# Altium schematic sheet USB Connectors.SchDoc
size A; SheetNumber: 5; SheetTotal: 7
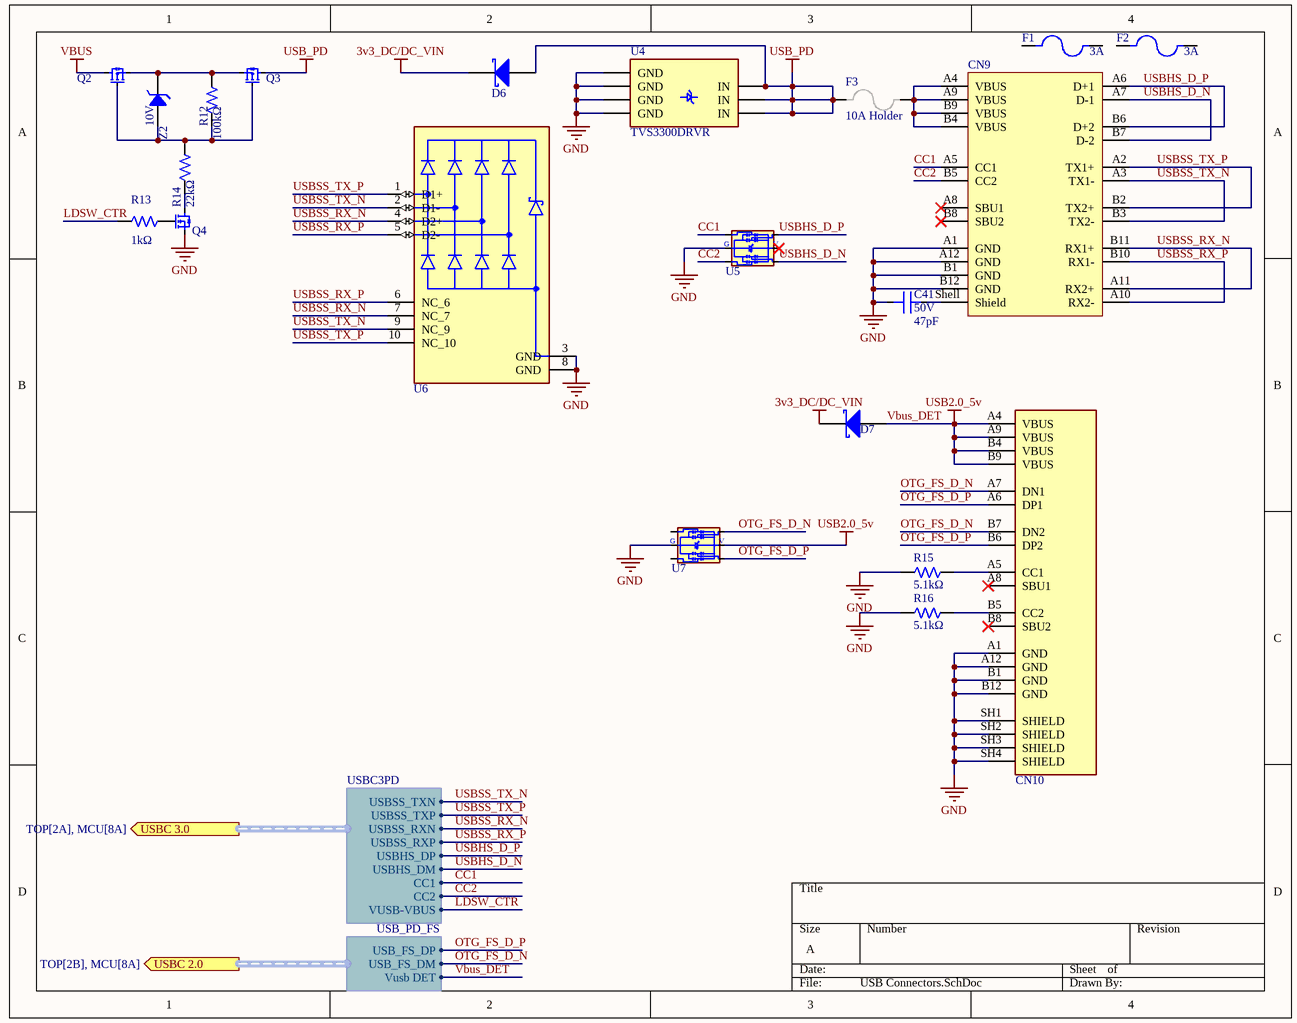
[diagram p0: USB Connectors.SchDoc]

## Parts
C41  Voltage Rating: 50V  Capacitance: 47pF  [C_0603]  (hidden comment: CAP CER 47pF 50V C0G 0603)
CN9  CONN RCPT USB 3.1 Type-C 24POS SMD R/A  [CONN_TYPE-C_24P_SMD_RA]  (value not drawn)
CN10  CONN RCPT USB 3.1 Type-C 16POS TH R/A  [CONN_TYPE-C_16P_TH_RA]  (value not drawn)
D6  DIODE SCHOTTKY 40V SOD-323  [SOD323]  (value not drawn)
D7  DIODE SCHOTTKY 40V SOD-323  [SOD323]  (value not drawn)
F1  3A  (mechanical)
F2  3A  (mechanical)
F3  10A Holder  [FUSE_SMD 2410 HOLDER]
Q2  MOSFET P-CH 30V 4A SOT-23  [SOT23]  (value not drawn)
Q3  MOSFET P-CH 30V 4A SOT-23  [SOT23]  (value not drawn)
Q4  MOSFET N-CH 30V SOT-23-3L  [SOT23]  (value not drawn)
R12  Resistance: 100kΩ  [R_0603]  (hidden comment: RES 100kΩ ±1% 100mW 0603)
R13  Resistance: 1kΩ  [R_0603]  (hidden comment: RES 1kΩ ±1% 100mW 0603)
R14  Resistance: 22kΩ  [R_0603]  (hidden comment: RES 22kΩ ±1% 100mW 0603)
R15  Resistance: 5.1kΩ  [R_0603]  (hidden comment: RES 5.1kΩ ±1% 100mW 0603)
R16  Resistance: 5.1kΩ  [R_0603]  (hidden comment: RES 5.1kΩ ±1% 100mW 0603)
U4  TVS3300DRVR  [WSON-6(2x2)]
U5  ESD DIODE 5.5VWM 18VC SOT-23-6  [SOT-23-6]  (value not drawn)
U6  TVS DIODE 5.5VWM 14VC USON-10(1x2.5)  [USON-10]  (value not drawn)
U7  ESD DIODE 5.5VWM 18VC SOT-23-6  [SOT-23-6]  (value not drawn)
Z2  Zener Voltage: 10V  [SOD123]  (hidden comment: DIODE ZENER 10V 500mW SOD-123)

## Ports
USBC 2.0 (out, harness USB_PD_FS, see TOP[2B], MCU[8A]), USBC 3.0 (out, harness USBC3PD, see TOP[2A], MCU[8A])

## Harnesses
USBC3PD: USBHS_DM, USBHS_DP, USBSS_RXP, USBSS_RXN, USBSS_TXP, USBSS_TXN, CC1, CC2, VUSB-VBUS
USB_PD_FS: USB_FS_DP, USB_FS_DM, Vusb DET

## Nets
3v3_DC/DC_VIN: D6.2(K) D7.2(K)
GND: C41.1 CN9.A1(GND) CN9.A12(GND) CN9.B1(GND) CN9.B12(GND) CN10.A1(GND) CN10.A12(GND) CN10.B1(GND) CN10.B12(GND) CN10.SH1(SHIELD) CN10.SH2(SHIELD) CN10.SH3(SHIELD) CN10.SH4(SHIELD) Q4.2(SOURCE) R15.1 R16.1 U4.1(GND) U4.2(GND) U4.3(GND) U4.7(GND) U5.2 U6.3(GND) U6.8(GND) U7.2
USB_PD: D6.1(A) F3.1 Q3.3(DRAIN) U4.4(IN) U4.5(IN) U4.6(IN)
VBUS: Q2.3(DRAIN)
Vbus_DET: CN10.A4(VBUS) CN10.A9(VBUS) CN10.B4(VBUS) CN10.B9(VBUS) D7.1(A) U7.5 ; port USBC 2.0.Vusb DET  [also labelled USB2.0_5v]
CC1: CN9.A5(CC1) U5.1 ; port USBC 3.0.CC1
CC2: CN9.B5(CC2) U5.3 ; port USBC 3.0.CC2
LDSW_CTR: R13.1 ; port USBC 3.0.VUSB-VBUS
OTG_FS_D_N: CN10.A7(DN1) CN10.B7(DN2) U7.6 ; port USBC 2.0.USB_FS_DM
OTG_FS_D_P: CN10.A6(DP1) CN10.B6(DP2) U7.4 ; port USBC 2.0.USB_FS_DP
USBHS_D_N: CN9.A7(D-1) CN9.B7(D-2) U5.4 ; port USBC 3.0.USBHS_DM
USBHS_D_P: CN9.A6(D+1) CN9.B6(D+2) U5.6 ; port USBC 3.0.USBHS_DP
USBSS_RX_N: CN9.A11(RX2+) CN9.B11(RX1+) U6.4(D2+) U6.7(NC_7) ; port USBC 3.0.USBSS_RXN
USBSS_RX_P: CN9.A10(RX2-) CN9.B10(RX1-) U6.5(D2-) U6.6(NC_6) ; port USBC 3.0.USBSS_RXP
USBSS_TX_N: CN9.A3(TX1-) CN9.B3(TX2-) U6.2(D1-) U6.9(NC_9) ; port USBC 3.0.USBSS_TXN
USBSS_TX_P: CN9.A2(TX1+) CN9.B2(TX2+) U6.1(D1+) U6.10(NC_10) ; port USBC 3.0.USBSS_TXP
NetC41_2: C41.2 CN9.Shell(Shield)
NetCN9_A4: CN9.A4(VBUS) CN9.A9(VBUS) CN9.B4(VBUS) CN9.B9(VBUS) F3.2
NetCN10_A5: CN10.A5(CC1) R15.2
NetCN10_B5: CN10.B5(CC2) R16.2
NetQ2_1: Q2.1(GATE) Q3.1(GATE) R12.1 R14.2 Z2.1
NetQ2_2: Q2.2(SOURCE) Q3.2(SOURCE) R12.2 Z2.2
NetQ4_1: Q4.1(GATE) R13.2
NetQ4_3: Q4.3(DRAIN) R14.1

Not connected (* = marked no-connect by the designer): CN9 A8(SBU1)* B8(SBU2)*; CN10 A8(SBU1)* B8(SBU2)*; F1 1 2; F2 1 2; U5 5*; U7 1 3

## Notes on the sheet
- (in symbol AOZ8904CIL) G; V

## Library data of the parts
C41 = C1671: 47pF ±5% 50V Ceramic Capacitor C0G 0603; Manufacturer: Samsung Electro-Mechanics; MPN: CL10C470JB8NNNC; Symbol Path 1: Symbols\Standard.SchLib; Unit Price (USD): 0.011; LCSC Part #: C1671; Package: 0603; JLC Part Type: Basic; LCSC Stock: 658700; JLC Stock: 1229214; MOQ: 100; Datasheet: https://datasheet.lcsc.com/datasheet/pdf/02336ea48ea44ca18c72517dd3cb7b47.pdf?productCode=C1671; URL: https://www.lcsc.com/product-detail/C1671.html; Status: ok; Tolerance: ±5%; TempCo: C0G
CN9 = TYPE-C 24P QT 143: USB-C (USB TYPE-C) Receptacle Connector 24 Position Surface Mount, Right Angle; Manufacturer: SHOU HAN; Symbol Path 1: Symbols\Standard.SchLib; Unit Price (USD): 0.4524; Positions: 24P; MPN: TYPE-C 24P QT 143; LCSC Part #: C5156605; Package: SMD; JLC Part Type: Extended; LCSC Stock: 27844; JLC Stock: 27844; MOQ: 1; Datasheet: https://datasheet.lcsc.com/datasheet/pdf/5e2518a21a03f1086118bfdc224ba041.pdf?productCode=C5156605; URL: https://www.lcsc.com/product-detail/C5156605.html; Status: ok; Mounting Type: Surface Mount, Right Angle; Type: Type-C
CN10 = TYPEC-306DDW-ARP16: USB-C (USB TYPE-C) Receptacle Connector 16 Position Right Angle; Manufacturer: XUNPU; Symbol Path 1: Symbols\Standard_CONN.SchLib; Unit Price (USD): 0.8482; Positions: 16P; MPN: TYPEC-306DDW-ARP16; LCSC Part #: C2840393; Package: THROUGH HOLE,RIGHT ANGLE; JLC Part Type: Extended; LCSC Stock: 2945; JLC Stock: 2962; MOQ: 1; Datasheet: https://datasheet.lcsc.com/datasheet/pdf/69a9ba2274492f854bbf6d61200cd4bb.pdf?productCode=C2840393; URL: https://www.lcsc.com/product-detail/C2840393.html; Status: ok; Mounting Type: Right Angle; Type: Type-C
D6 D7 = 1N5819WS: Diode 40V 1A Surface Mount SOD-323; Manufacturer: Guangdong Hottech; Symbol Path 1: Symbols\Standard.SchLib; Unit Price (USD): 0.0139; Forward Voltage: 600mV@1A; MPN: 1N5819WS; LCSC Part #: C191023; Package: SOD-323; JLC Part Type: Basic; LCSC Stock: 4984450; JLC Stock: 5626571; MOQ: 50; Datasheet: https://datasheet.lcsc.com/datasheet/pdf/c7a6590686b7be2f86b8eed4480e569c.pdf?productCode=C191023; URL: https://www.lcsc.com/product-detail/C191023.html; Status: ok; Voltage Rating: 40V; Current Rating: 1A; Subcategory: Schottky
F1 F2 = JFC2410-1300FS: FUSE BRD MNT 3A 2410; Supplier 1: LCSC; Supplier Part Number 1: C2994709; ComponentLink1Description: Makers; ComponentLink1URL: https://makerselectronics.com/product/smd-fuse-fast-blow-3a-2410-50a-6-1x2-69x2-69mm/
F3 = 01550900M: FUSE BLOK CARTRIDGE 125V 10A SMD; Supplier 1: DigiKey; Supplier Part Number 1: F1889-ND; Supplier 2: LCSC; Supplier Part Number 2: C108518
Q2 Q3 = AO3401A: 30V 4A Surface Mount SOT-23; Manufacturer: AOS; Symbol Path 1: Symbols\Standard.SchLib; Unit Price (USD): 0.0951; Rds: 47mΩ@10V;60mΩ@4.5V;85mΩ@2.5V; Vgs(th): 900mV; MPN: AO3401A; LCSC Part #: C15127; Package: SOT-23; JLC Part Type: Basic; LCSC Stock: 115510; JLC Stock: 469891; MOQ: 5; Datasheet: https://datasheet.lcsc.com/datasheet/pdf/fee353dd1e9e0bc90b295f14f381aa4c.pdf?productCode=C15127; URL: https://www.lcsc.com/product-detail/C15127.html; Status: ok; Vds: 30V; Id: 4A
Q4 = AO3400A: N-Channel 30V Surface Mount SOT-23-3L; Manufacturer: AOS; Symbol Path 1: Symbols\Standard.SchLib; Unit Price (USD): 0.0849; Id: 5.7A; Rds: 48mΩ@2.5V; Vgs(th): 1.45V; Supplier 1: DigiKey; Supplier Part Number 1: 785-1000-1-ND; Supplier 2: LCSC; Supplier Part Number 2: C20917; MPN: AO3400A; LCSC Part #: C20917; Package: SOT-23; JLC Part Type: Basic; LCSC Stock: 656120; JLC Stock: 1217370; MOQ: 5; Datasheet: https://datasheet.lcsc.com/datasheet/pdf/130876b936da464599428c58fd8de8f6.pdf?productCode=C20917; URL: https://www.lcsc.com/product-detail/C20917.html; Status: ok; Type: N-Channel; Vds: 30V
R12 = C25803: 100kΩ ±1% 100mW 0603 Thick Film Resistor; MPN: 0603WAF1003T5E; Manufacturer: UNI-ROYAL; Symbol Path 1: Symbols\Standard.SchLib; Unit Price (USD): 0.0042; Voltage Rating: 75V; TempCo: ±100ppm/℃; LCSC Part #: C25803; Package: 0603; Datasheet: https://datasheet.lcsc.com/datasheet/pdf/0a975aaa49b7c97f38a963127be4a823.pdf?productCode=C25803; Power: 100mW; JLC Part Type: Basic; LCSC Stock: 13059500; JLC Stock: 21549170; MOQ: 100; URL: https://www.lcsc.com/product-detail/C25803.html; Status: ok; Tolerance: ±1%; Composition: Thick Film Resistor
R13 = 0603WAF1001T5E: 1kΩ ±1% 100mW 0603 Thick Film Resistor; Manufacturer: UNI-ROYAL; Symbol Path 1: Symbols\Standard.SchLib; Unit Price (USD): 0.0058; Voltage Rating: 75V; TempCo: ±100ppm/℃; MPN: 0603WAF1001T5E; Package: 0603; Datasheet: https://datasheet.lcsc.com/datasheet/pdf/0a975aaa49b7c97f38a963127be4a823.pdf?productCode=C21190; Power: 100mW; LCSC Part #: C21190; JLC Part Type: Basic; LCSC Stock: 7626000; JLC Stock: 31254885; MOQ: 100; URL: https://www.lcsc.com/product-detail/C21190.html; Status: ok; Tolerance: ±1%; Composition: Thick Film Resistor
R14 = C31850: 22kΩ ±1% 100mW 0603 Thick Film Resistor; MPN: 0603WAF2202T5E; Manufacturer: UNI-ROYAL; Symbol Path 1: Symbols\Standard.SchLib; Unit Price (USD): 0.0067; Voltage Rating: 75V; TempCo: ±100ppm/℃; LCSC Part #: C31850; Package: 0603; Datasheet: https://datasheet.lcsc.com/datasheet/pdf/0a975aaa49b7c97f38a963127be4a823.pdf?productCode=C31850; Power: 100mW; JLC Part Type: Basic; LCSC Stock: 3044300; JLC Stock: 4293246; MOQ: 100; URL: https://www.lcsc.com/product-detail/C31850.html; Status: ok; Tolerance: ±1%; Composition: Thick Film Resistor
R15 R16 = 0603WAF5101T5E: 5.1kΩ ±1% 100mW 0603 Thick Film Resistor; Manufacturer: UNI-ROYAL; Symbol Path 1: Symbols\Standard.SchLib; Unit Price (USD): 0.0026; Voltage Rating: 75V; TempCo: ±100ppm/℃; MPN: 0603WAF5101T5E; Package: 0603; Datasheet: https://datasheet.lcsc.com/datasheet/pdf/0a975aaa49b7c97f38a963127be4a823.pdf?productCode=C23186; Power: 100mW; LCSC Part #: C23186; JLC Part Type: Basic; LCSC Stock: 11090800; JLC Stock: 15519253; MOQ: 100; URL: https://www.lcsc.com/product-detail/C23186.html; Status: ok; Tolerance: ±1%; Composition: Thick Film Resistor
U4 = TVS3300DRVR: Surge Protection IC Surface Mount WSON-6(2x2); Manufacturer: TI; Symbol Path 1: Symbols\Standard_ICs.SchLib; Unit Price (USD): 0.5261; MPN: TVS3300DRVR; LCSC Part #: C2863624; Package: WSON-6(2x2); JLC Part Type: Extended; LCSC Stock: 353; JLC Stock: 353; MOQ: 1; Datasheet: https://www.ti.com/cn/lit/ds/symlink/tvs3300.pdf; URL: https://www.lcsc.com/product-detail/C2863624.html; Status: ok; Category: Circuit Protection; Subcategory: Surge Suppression ICs
U5 U7 = AOZ8904CIL: 18VC Clamp 4A@8/20us Ipp ESD DIODE SOT-23-6; Manufacturer: AOS; Symbol Path 1: Symbols\Standard.SchLib; Unit Price (USD): 0.1038; Reverse Standoff: 5.5V; Breakdown: 6.6V; Clamping: 18V; Channels: 4; Power: 50W; MPN: AOZ8904CIL; LCSC Part #: C2649893; Package: SOT-23-6; JLC Part Type: Extended; LCSC Stock: 22685; JLC Stock: 22688; MOQ: 5; Datasheet: https://datasheet.lcsc.com/datasheet/pdf/ff96264e99333206af656f0798b8a3ce.pdf?productCode=C2649893; URL: https://www.lcsc.com/product-detail/C2649893.html; Status: ok
U6 = TPD4E05U06DQAR: 14VC Clamp 2.5A@8/20us Ipp TVS DIODE USON-10(1x2.5); Manufacturer: TI; Symbol Path 1: Symbols\Standard.SchLib; Unit Price (USD): 0.0873; Reverse Standoff: 5.5V; Breakdown: 6.5V; Clamping: 14V; Channels: 4; Polarity: Unidirectional; Power: 40W@8/20us; MPN: TPD4E05U06DQAR; LCSC Part #: C138714; Package: USON-10(1x2.5); JLC Part Type: Extended; LCSC Stock: 52940; JLC Stock: 53051; MOQ: 5; Datasheet: https://datasheet.lcsc.com/datasheet/pdf/86fce5e377410b6c2d1b0526f306f55e.pdf?productCode=C138714; URL: https://www.lcsc.com/product-detail/C138714.html; Status: ok
Z2 = MM1Z10B: Zener Diode Independent 10V 500mW Surface Mount SOD-123; Manufacturer: R+O; Symbol Path 1: Symbols\Standard.SchLib; Unit Price (USD): 0.0253; MPN: MM1Z10B; LCSC Part #: C22466341; Package: SOD-123; JLC Part Type: Extended; LCSC Stock: 58240; JLC Stock: 58248; MOQ: 20; Datasheet: https://datasheet.lcsc.com/datasheet/pdf/907cba31244dca3d738fcc4264c58834.pdf?productCode=C22466341; URL: https://www.lcsc.com/product-detail/C22466341.html; Status: ok; Subcategory: Zener